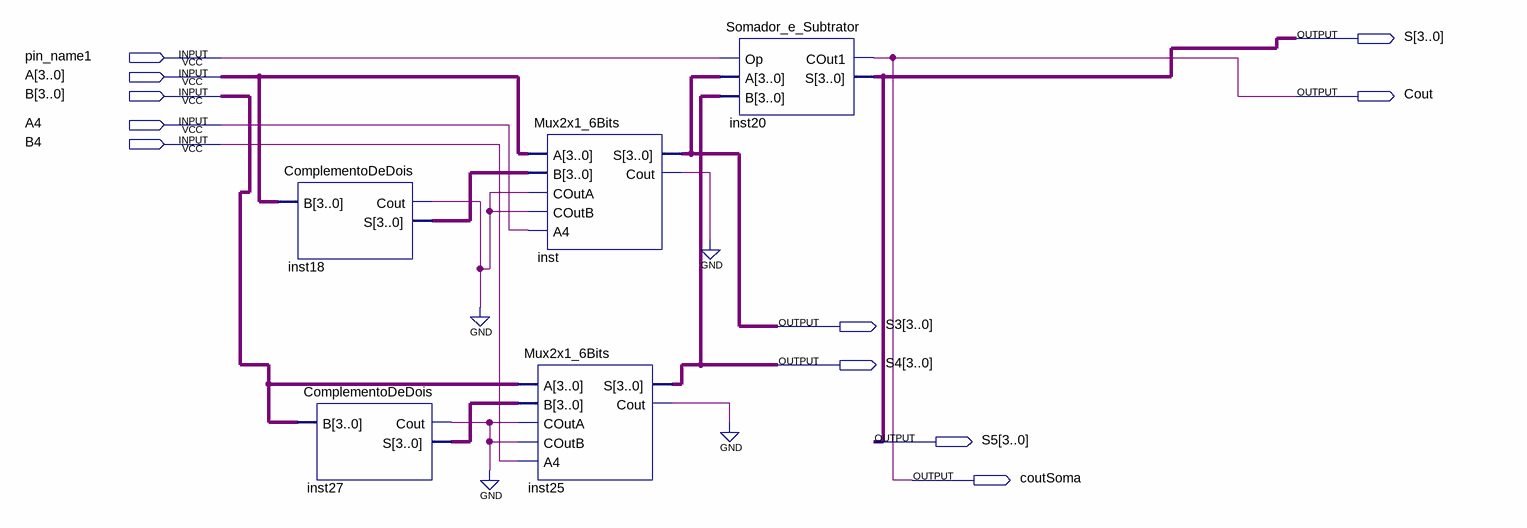
[diagram p0: schematic sheet]
// Quartus schematic testeAltera.bdf as structural Verilog: 5 symbols, 11 pins
module testeAltera (
  input  pin_name1,
  input  [3:0] A,
  input  [3:0] B,
  input  A4,
  input  B4,
  output [3:0] S,
  output Cout,
  output [3:0] S3,
  output [3:0] S4,
  output [3:0] S5,
  output coutSoma
);

  wire inst18_cout, inst25_cout, inst27_cout, inst_cout;
  wire [3:0] inst18_s, inst27_s;

  ComplementoDeDois inst18 (.B(A), .Cout(inst18_cout), .S(inst18_s));
  ComplementoDeDois inst27 (.B(B), .Cout(inst27_cout), .S(inst27_s));
  Mux2x1_6Bits inst (.A(A), .B(inst18_s), .COutA(inst18_cout), .COutB(inst18_cout), .A4(A4), .S(S3), .Cout(inst_cout));
  Mux2x1_6Bits inst25 (
    .A(B), .B(inst27_s), .COutA(inst27_cout), .COutB(inst27_cout), .A4(B4), .S(S4), .Cout(inst25_cout));
  Somador_e_Subtrator inst20 (.Op(pin_name1), .A(S3), .B(S4), .COut1(Cout), .S(S));

  assign coutSoma = Cout;
  assign S5 = S;
  // also tied to GND on the sheet: {inst25_cout, inst27_cout, inst_cout, inst18_cout}
endmodule
